# EAGLE design iod-node (EAGLE 7.5.0)
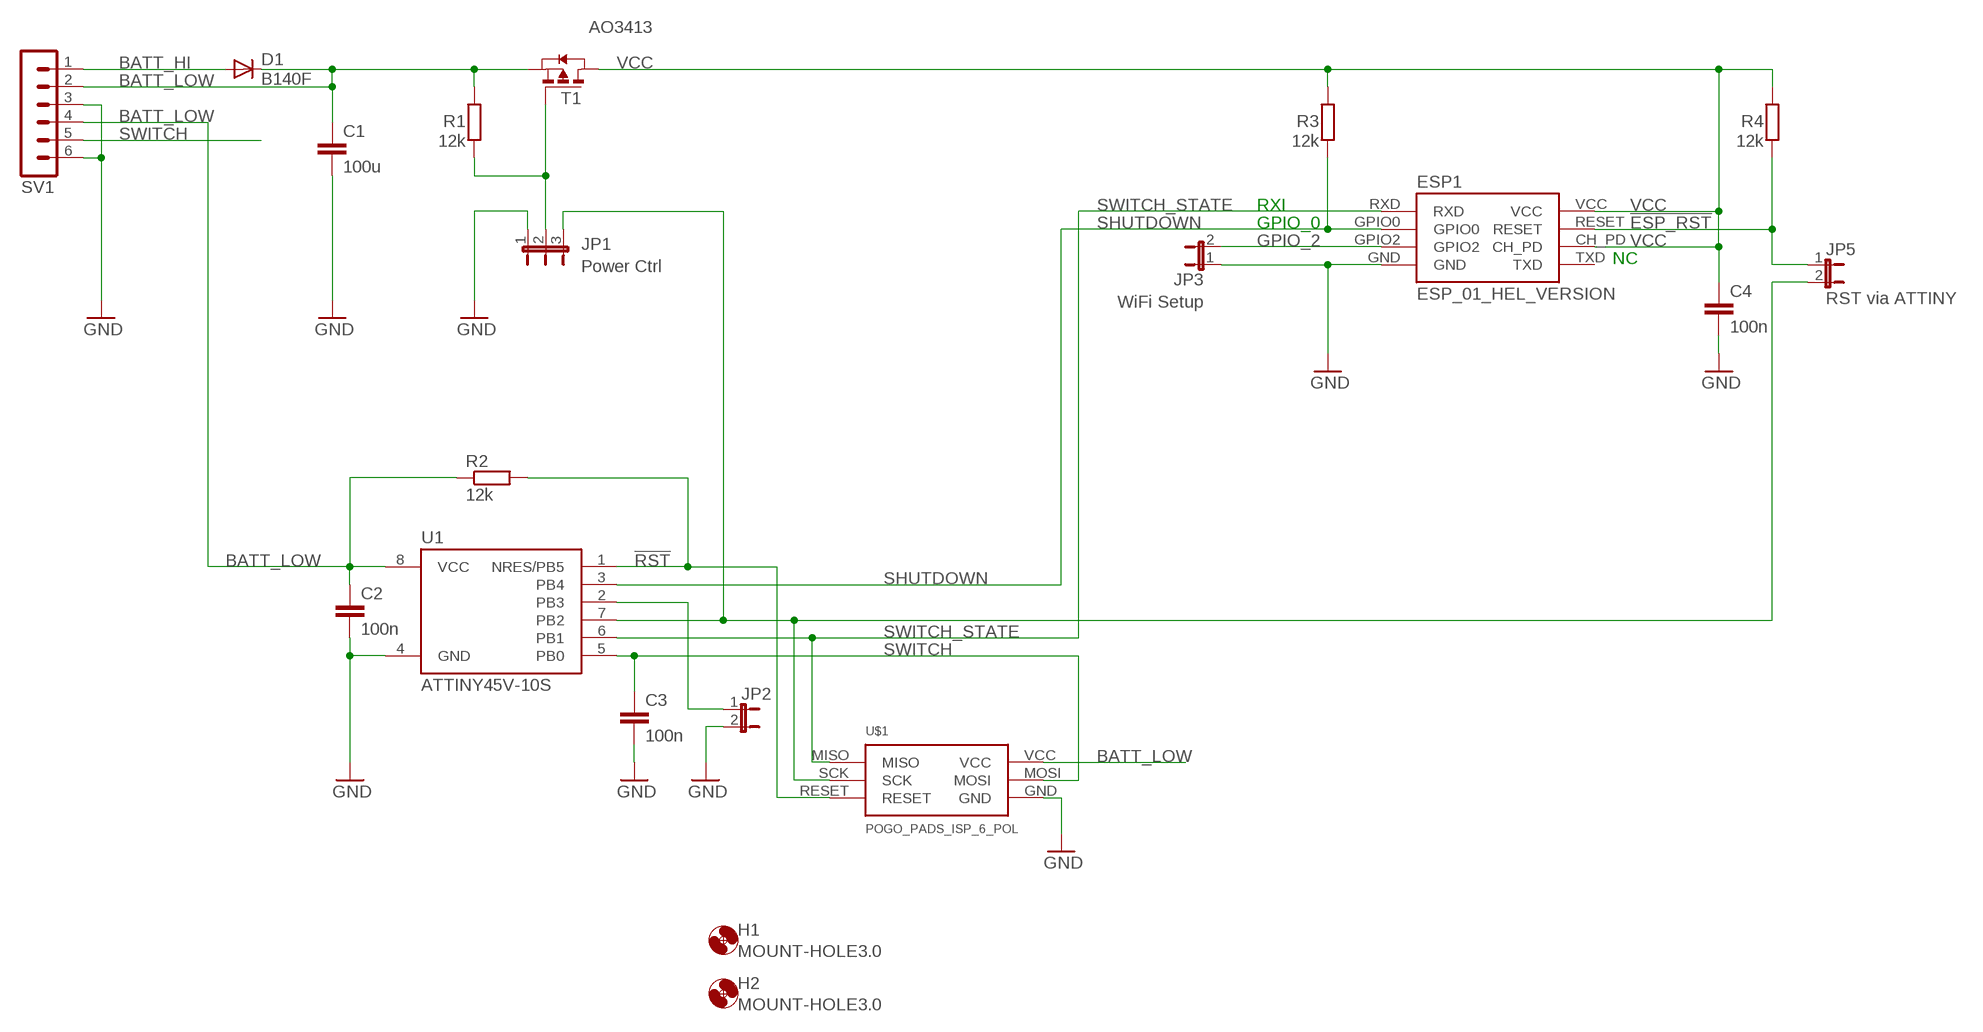
[diagram p0: schematic, sheet 1]

## Parts
C1  100u  C-EUC1210  [C1210]
C2  100n  C-EUC3225  [C3225]
C3  100n  C-EUC3225  [C3225]
C4  100n  C-EUC3225  [C3225]
D1  B140F  DIODE-DO214AA  [DO214AA]
ESP1  ESP_01_HEL_VERSION  [CUSTOM_ESP01_FOR_HEL]
H1  MOUNT-HOLE3.0  [3,0]
H2  MOUNT-HOLE3.0  [3,0]
JP1  Power Ctrl  JP2E  [JP2]
JP2  JP1E  [JP1]
JP3  WiFi Setup  JP1E  [JP1]
JP5  RST via ATTINY  JP1E  [JP1]
R1  12k  R-EU_R0805  [R0805]
R2  12k  R-EU_R0805  [R0805]
R3  12k  R-EU_R0805  [R0805]
R4  12k  R-EU_R0805  [R0805]
SV1  MA06-1  [MA06-1]
T1  AO3413  PMOSSOT23  [SOT-23]
U1  ATTINY45V-10S  [SOIC8_EIAJ_208MIL]
U$1  POGO_PADS_ISP_6_POL  [POGO_PADS_ISP_6_POL]

## Nets
!ESP_RST: ESP1.RESET JP5.1 R4.1
!RST: R2.2 U1.1(NRES/PB5) U$1.RESET
BATT_HI: D1.A SV1.1
BATT_LOW: C1.1 C2.1 D1.C R1.2 R2.1 SV1.2 SV1.4 T1.2(S) U1.8(VCC) U$1.VCC
GND: C1.2 C2.2 C3.2 C4.2 ESP1.GND JP1.1 JP2.2 JP3.1 SV1.3 SV1.6 U1.4(GND) U$1.GND
GPIO_2: ESP1.GPIO2 JP3.2
N$1: JP2.1 U1.2(PB3)
N$5: JP1.2 R1.1 T1.3(G)
N$8: JP1.3 JP5.2 U1.7(PB2) U$1.SCK
SHUTDOWN: ESP1.GPIO0 R3.1 U1.3(PB4)
SWITCH: C3.1 SV1.5 U1.5(PB0) U$1.MOSI
SWITCH_STATE: ESP1.RXD U1.6(PB1) U$1.MISO
VCC: C4.1 ESP1.CH_PD ESP1.VCC R3.2 R4.2 T1.1(D)
Unconnected: ESP1.TXD

## Notes on the sheet
- RXI
- GPIO_0
- NC

## Library data of the parts
C1-C4 = resistor:C-EU: CAPACITOR, European symbol
D1 = diode:DIODE-: DIODE
ESP1 = ESP_HEL_VERSION:ESP_01_HEL_VERSION
H1 H2 = holes:MOUNT-HOLE: MOUNTING HOLE with drill center marker
JP1 = jumper:JP2E: JUMPER
JP2 JP3 JP5 = jumper:JP1E: JUMPER
R1-R4 = rcl:R-EU_: RESISTOR, European symbol
SV1 = con-lstb:MA06-1: PIN HEADER; OC_FARNELL: unknown; OC_NEWARK: unknown
T1 = zetex:PMOSSOT23: MOS FET; OC_FARNELL: unknown; OC_NEWARK: unknown
U1 = _hhn_attiny25_45_85:ATTINY45*: ATMEL ATtiny 45 Packages: P = PDIP 08 30mil S = SOIC 08 EIAJ 208mil X = TSSOP 08 4.4mm Technologies Note: for complete ordering code (temp. range, finish, tape&reel etc.) see www.atmel.com • Supply Voltage: V = (1.8…5.5)V | [blank] = (2.7…5.5)V • Speed: 10 = 10 MHz | 20 = 20 MHz Author: Dipl.-Ing. FH Rainer Bayer HHN Hochschule Heilbronn (Heilbronn University), rainer.bayer@hs-heilbronn.de Ingenieurbüro ing-rb, mail@ing-rb.de
U$1 = pogo_pads_ISP_6_pol:POGO_PADS_ISP_6_POL

## Board
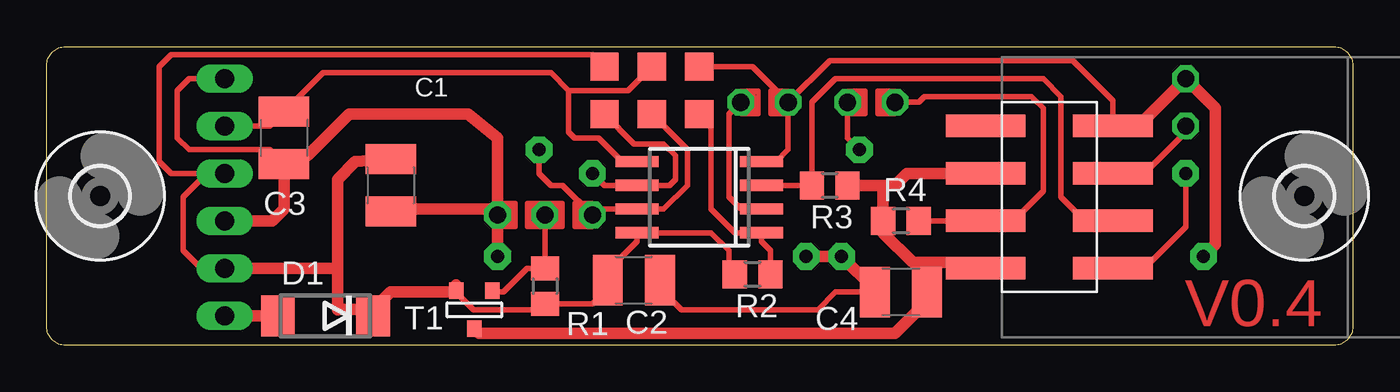
[diagram p1: board, top side]
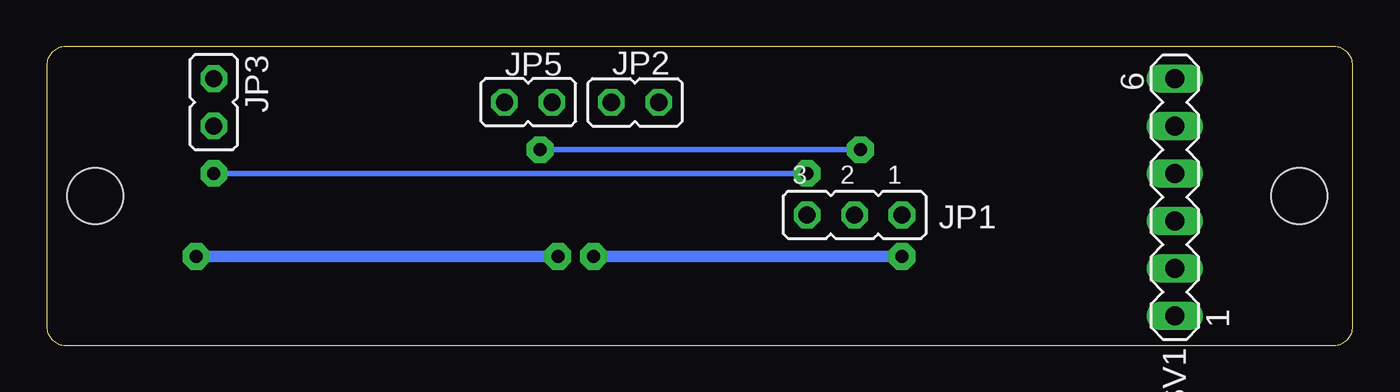
[diagram p2: board, bottom side, seen from below]

Size 69.91 x 16 mm. Coordinates in mm from the lower left corner, seen from the top.
Outline: 1,0 arc-90 0,1 0,15 arc-90 1,16 68.91,16 arc-90 69.91,15 69.91,1 arc-90 68.91,0 1,0
Copper layers (1*16): Top 0.035mm / dielectric 1.5mm / Bottom 0.035mm
Design rules "default *": minimum track width 10mil, minimum drill 24mil, track to track 8mil, track to pad 8mil, pad to pad 8mil, via to via 8mil, smd to smd 8mil, copper to edge 10mil, drill to drill 8mil, minimum pad ring 10mil, minimum via ring 8mil, stop-mask expansion 4mil, vias tented up to drill 0mil, thermal gap 10mil

### Footprints (pad centres in the part's own frame; a part is rotated, then mirrored left to right if it is on the bottom)
C1210 = smd 1.6 x 2.7: 1 -1.4,0; 2 1.4,0
C3225 = smd 1.6 x 2.7: 1 -1.4,0; 2 1.4,0
DO214AA = smd 1.8 x 2.2: A 2.55,0; C -2.55,0
CUSTOM_ESP01_FOR_HEL = smd 4.27 x 1.2: CH_PD -3.4,1.27; GND 3.4,3.81; GPIO0 3.4,-1.27; GPIO2 3.4,1.27; RESET -3.4,-1.27; RXD 3.4,-3.81; TXD -3.4,3.81; VCC -3.4,-3.81
3,0 = hole 3: 0,0
JP2 = drill 0.914 octagon: 1 -2.54,0; 2 0,0; 3 2.54,0
JP1 = drill 0.914 octagon: 1 0,-1.27; 2 0,1.27
R0805 = smd 1.3 x 1.5: 1 -0.95,0; 2 0.95,0
MA06-1 = drill 1.016 long: 1 -6.35,0; 2 -3.81,0; 3 -1.27,0; 4 1.27,0; 5 3.81,0; 6 6.35,0
SOT-23 = smd 0.787 x 0.889: 1 0.025,-1.016; 2 -0.94,1.016; 3 0.991,1.016
SOIC8_EIAJ_208MIL = smd 0.6 x 2.286: 1 -1.905,-3.33; 2 -0.635,-3.33; 3 0.635,-3.33; 4 1.905,-3.33; 5 1.905,3.33; 6 0.635,3.33; 7 -0.635,3.33; 8 -1.905,3.33
POGO_PADS_ISP_6_POL = smd 1.5 x 1.5: GND 2.54,-2.54; MISO 0,2.54; MOSI 2.54,0; RESET 0,-2.54; SCK 0,0; VCC 2.54,2.54

### Placement (x,y rotation side)
C1  18.42,8.57 270 top
C2  31.43,3.49 0 top
C3  12.7,11.11 270 top
C4  45.72,2.86 180 top
D1  14.92,1.59 180 top
ESP1  53.66,7.94 0 top
H1  2.86,8 0 top
H2  67.31,8 0 top
JP1  26.67,6.99 180 bottom
JP2  38.42,13.02 90 bottom
JP3  60.96,13.02 180 bottom
JP5  44.13,13.02 270 bottom
R1  26.67,3.17 270 top
R2  37.78,3.81 0 top
R3  41.91,8.57 0 top
R4  45.72,6.67 180 top
SV1  9.53,7.94 90 bottom
T1  22.86,1.91 0 top
U1  34.93,7.94 90 top
U$1  32.38,12.38 90 top

### Tracks (layer width: path | path; a pad name or v marks a point on that pad's centre or on a via)
!ESP_RST
  Top 0.25: JP5.1 45.4,13.34 45.4,13.65 44.45,13.65 | 44.45,13.65 44.45,12.38 | 44.45,12.38 45.4,12.38 | 44.45,13.65 44.77,13.34 | 44.77,12.7 44.45,12.38
  Top 0.305: R4.1 ESP1.RESET 51.75,6.67 53.34,8.26 53.34,12.7 52.7,13.34 46.99,13.34 46.67,13.02 JP5.1
  Top 0.406: 45.4,13.34 44.77,13.34 44.77,12.7 45.4,12.7
!RST
  Top 0.305: R2.2 38.73,5.08 38.26,5.56 U1.1 36.83,6.03 35.56,7.3 35.56,11.75 U$1.RESET
BATT_HI
  Top 0.61: SV1.1 D1.A
BATT_LOW
  Top 0.305: U$1.VCC 29.21,15.56 6.67,15.56 6.03,14.92 6.03,9.84 6.67,9.21 8.57,9.21 | 8.57,9.21 SV1.4 | SV1.2 8.25,4.13 7.3,5.08 7.3,7.94 8.57,9.21 | R2.1 36.51,4.13 36.51,5.08 35.56,6.03 U1.8 31.6,5.56 30.48,4.45 30.48,3.94 C2.1 29.85,3.31 29.85,2.86 29.21,2.23 R1.2 26.35,1.91 22.86,1.91 21.92,2.85 T1.2
  Top 0.61: SV1.2 15.56,4.13 | 21.92,3.24 T1.2 21.92,2.86 18.42,2.86 17.47,1.92 | D1.C 17.47,1.92 | 15.56,4.13 15.56,8.89 16.51,9.84 C1.1 | 17.47,1.92 15.56,1.92 | 15.56,1.92 15.56,1.91 | 15.56,1.92 15.56,4.13 | 18.42,9.53 C1.1 | C1.1 18.42,10.16
GND  (via drill 0.7 pad 1.42)
  Top 0.25: 24.13,7.62 25.08,7.62 | 25.08,7.62 25.08,6.35 | 25.08,6.35 24.13,6.35 | JP2.2 39.69,13.34 39.69,13.65 38.73,13.65 | 38.73,13.65 38.73,12.38 | 38.73,12.38 39.69,12.38 | 38.73,13.65 39.05,13.34 | 39.05,12.7 38.73,12.38 | 25.08,7.62 24.77,7.3 | 24.77,6.67 25.08,6.35
  Top 0.305: U$1.GND 37.78,14.92 JP2.2 | ESP1.GND 57.06,13.11 54.93,15.24 41.91,15.24 JP2.2 | SV1.6 7.62,14.29 6.99,13.65 6.99,11.11 7.62,10.48 11.93,10.48 C3.2 | C4.2 42.23,2.86 41.27,1.91 33.97,1.91 33.02,2.86 33.02,3.31 C2.2 | JP2.2 39.69,12.7 39.69,12.38 39.69,10.48 39.05,9.84 U1.4
  Top 0.406: 24.13,7.3 24.77,7.3 24.77,6.67 24.13,6.67 | 39.69,13.34 39.05,13.34 39.05,12.7 39.69,12.7
  Top 0.61: SV1.3 12.06,6.67 12.7,7.3 C3.2 12.7,10.16 13.97,10.16 16.19,12.38 22.54,12.38 24.13,11.11 JP1.1 | 24.13,7.3 JP1.1 | v24.13,4.76 24.13,6.35 24.13,6.67 JP1.1 | v40.64,4.76 v42.55,4.76 44.32,2.99 C4.2 | v61.91,4.76 62.55,5.4 62.55,12.7 JP3.1 58.42,11.75 ESP1.GND | 24.13,7.62 24.13,7.3 | 24.13,7.3 18.42,7.3 C1.2
  Bottom 0.61: v40.64,4.76 v24.13,4.76 | v42.55,4.76 v61.91,4.76
GPIO_2
  Top 0.305: ESP1.GPIO2 58.74,9.21 60.96,11.43 JP3.2
N$1
  Top 0.25: 37.15,13.65 38.1,13.65 | 38.1,12.38 37.15,12.38 | JP2.1 38.1,13.65 | 38.1,13.65 38.1,12.38 | 38.1,12.38 37.78,12.7
  Top 0.305: U1.2 37.15,7.3 36.51,7.94 36.51,12.38 JP2.1
  Top 0.406: 37.15,13.34 37.78,13.34 37.78,12.7 37.15,12.7
N$5
  Top 0.25: 25.72,6.35 26.67,6.35 27.62,6.35 | 25.72,6.35 25.72,7.62 | 25.72,7.62 26.67,7.62 | 26.67,7.62 JP1.2 | 27.62,6.35 27.62,7.62 | 27.62,7.62 26.67,7.62 | 25.72,7.62 26.04,7.3 | 26.04,6.67 25.72,6.35 | 27.62,7.62 27.3,7.3 | 27.3,6.67 27.62,6.35
  Top 0.305: R1.1 | R1.1 | 26.67,6.35 R1.1 | R1.1 25.72,4.13 24.45,2.86 23.91,2.86 T1.3
  Top 0.406: 26.67,6.67 26.67,6.35 | JP1.2 26.67,6.67 | 26.67,6.67 26.04,6.67 26.04,7.3 27.3,7.3 27.3,6.67 26.67,6.67
N$8  (via drill 0.7 pad 1.42)
  Top 0.25: 28.58,7.62 29.21,7.62 29.21,7.3 JP1.3 29.21,6.67 29.21,6.35 28.58,6.35 | 28.58,7.62 28.26,7.62 28.26,7.3 | 28.26,6.67 28.26,6.35 28.58,6.35 | JP5.2 42.86,13.34 42.86,13.65 43.81,13.65 | 43.81,13.65 43.81,12.38 | 43.81,12.38 42.86,12.38 | 43.81,13.65 43.5,13.34 | 43.5,12.7 43.81,12.38 | 28.58,7.62 28.26,7.3 | 28.26,7.3 28.26,6.67 | 28.26,6.67 28.58,6.35
  Top 0.305: JP5.2 42.86,12.7 42.86,12.38 42.86,11.11 v43.5,10.48 | U$1.SCK 34.29,10.48 34.29,8.57 33.02,7.3 U1.7 29.53,7.3 JP1.3 27.62,8.57 26.99,8.57 26.35,9.21 v26.35,10.48
  Top 0.406: 29.21,7.3 28.58,7.3 28.58,6.67 29.21,6.67 | 42.86,13.34 43.5,13.34 43.5,12.7 42.86,12.7
  Bottom 0.305: v43.5,10.48 v26.35,10.48
SHUTDOWN
  Top 0.305: U1.3 R3.1 40.96,13.02 42.23,14.29 53.34,14.29 54.29,13.34 54.29,7.94 55.56,6.67 ESP1.GPIO0
SWITCH
  Top 0.305: U$1.MOSI 31.12,13.65 27.94,13.65 | 27.94,13.65 26.99,14.61 14.79,14.61 C3.1 11.93,11.75 SV1.5 | U1.5 30.8,9.84 29.53,11.11 28.26,11.11 27.94,11.43 27.94,13.65
SWITCH_STATE  (via drill 0.7 pad 1.42)
  Top 0.305: U$1.MISO 31.43,10.79 33.02,10.79 33.66,10.16 33.66,8.89 33.34,8.57 U1.6 29.85,8.57 v29.21,9.21 | ESP1.RXD 58.74,4.13 60.96,6.35 v60.96,9.21
  Bottom 0.305: v60.96,9.21 v29.21,9.21
VCC
  Top 0.305: R4.2
  Top 0.61: R3.2 44.77,8.57 | 44.77,8.57 45.4,8.57 46.04,9.21 ESP1.CH_PD | 44.77,8.57 R4.2 44.77,6.03 46.36,4.45 46.99,4.45 | 46.99,4.45 49.94,4.45 ESP1.VCC | 46.99,4.45 47.12,4.32 C4.1 46.99,2.73 46.99,2.22 45.4,0.64 23.14,0.64 T1.1

### Text on the board
Top: V0.4